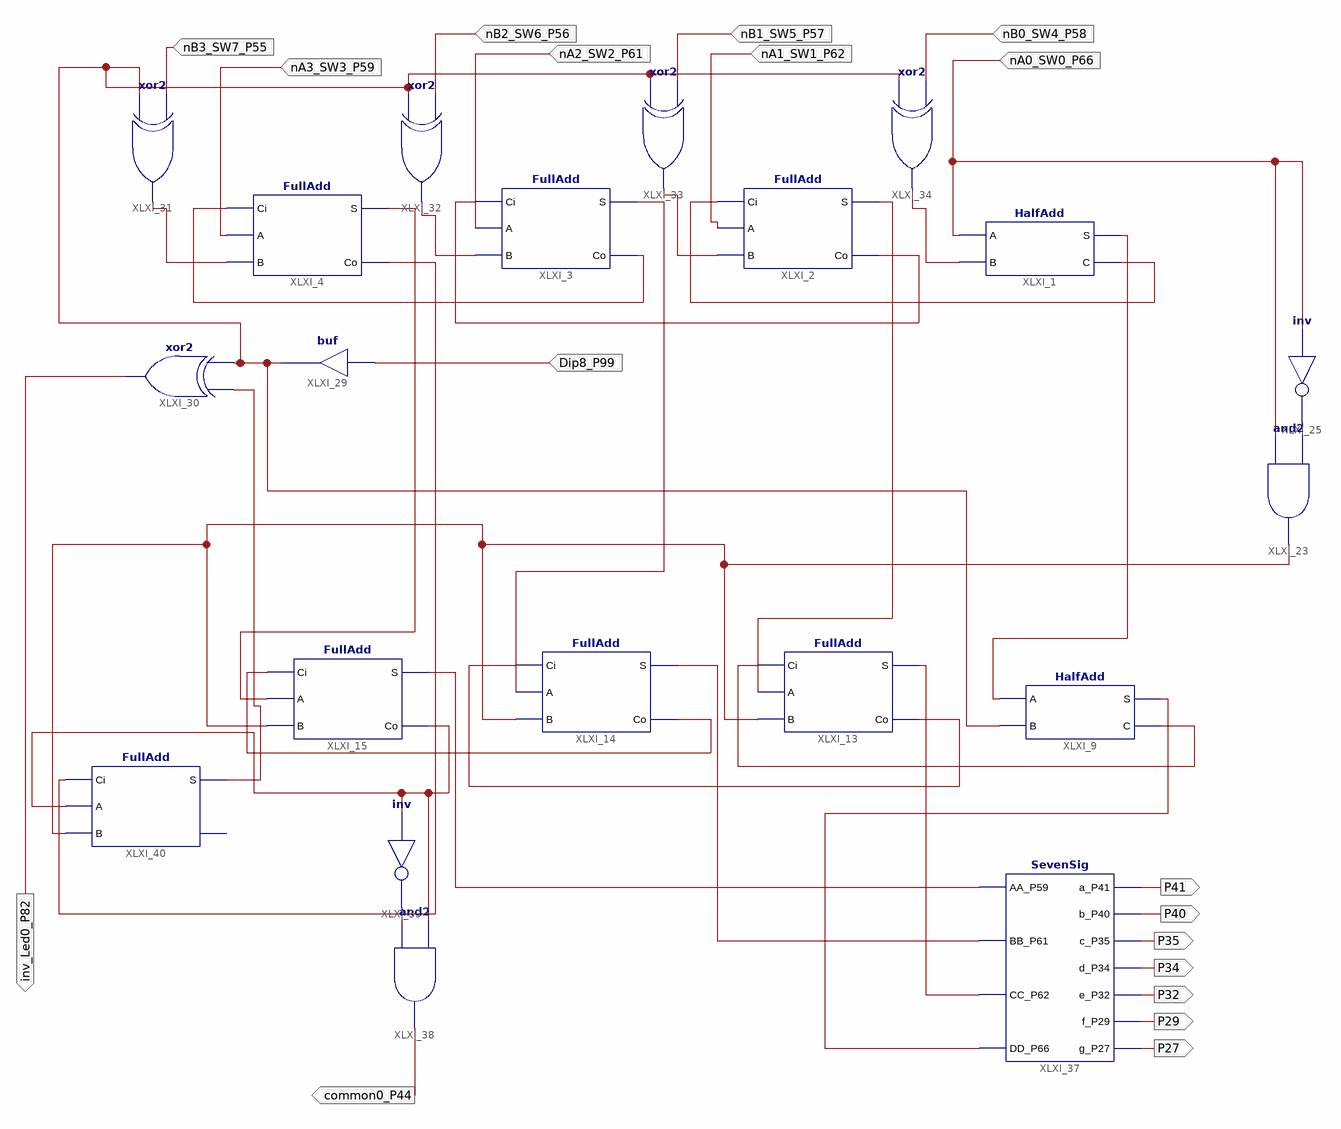
[diagram p0: schematic sheet 1]
// Xilinx ISE schematic Lab6_Mix.sch (spartan6) as structural Verilog: 20 symbols, 18 ports
module Lab6_Mix (
  input  nA0_SW0_P66,
  input  nA1_SW1_P62,
  input  nA2_SW2_P61,
  input  nB0_SW4_P58,
  input  nB1_SW5_P57,
  input  nB2_SW6_P56,
  input  nA3_SW3_P59,
  input  Dip8_P99,
  input  nB3_SW7_P55,
  output inv_Led0_P82,
  output P34,
  output P32,
  output P27,
  output P29,
  output P35,
  output P41,
  output P40,
  output common0_P44
);

  wire s0_Led4_P78, s1_Led5_P75, s2_Led6_P74, sum0_Led4_P78, sum1_Led5_P75, sum2_Led6_P74, sum3_Led7_P67,
       XLXN_3, XLXN_8, XLXN_69, XLXN_74, XLXN_91, XLXN_105, XLXN_106, XLXN_107, XLXN_109, XLXN_115, XLXN_116,
       XLXN_134, XLXN_137, XLXN_152, XLXN_156, XLXN_158, XLXN_159, XLXN_160;

  HalfAdd XLXI_1 (.A(nA0_SW0_P66), .B(XLXN_109), .S(s0_Led4_P78), .C(XLXN_3));
  FullAdd XLXI_2 (.Ci(XLXN_3), .A(nA1_SW1_P62), .B(XLXN_137), .S(s1_Led5_P75), .Co(XLXN_8));
  FullAdd XLXI_3 (.Ci(XLXN_8), .A(nA2_SW2_P61), .B(XLXN_107), .S(s2_Led6_P74), .Co(XLXN_105));
  FullAdd XLXI_4 (.Ci(XLXN_105), .A(nA3_SW3_P59), .B(XLXN_106), .S(XLXN_115), .Co(XLXN_158));
  HalfAdd XLXI_9 (.A(s0_Led4_P78), .B(XLXN_134), .S(sum0_Led4_P78), .C(XLXN_69));
  FullAdd XLXI_13 (.Ci(XLXN_69), .A(s1_Led5_P75), .B(XLXN_159), .S(sum1_Led5_P75), .Co(XLXN_74));
  FullAdd XLXI_14 (.Ci(XLXN_74), .A(s2_Led6_P74), .B(XLXN_159), .S(sum2_Led6_P74), .Co(XLXN_116));
  FullAdd XLXI_15 (.Ci(XLXN_116), .A(XLXN_115), .B(XLXN_159), .S(sum3_Led7_P67), .Co(XLXN_156));
  and XLXI_23 (XLXN_159, nA0_SW0_P66, XLXN_91);
  not XLXI_25 (XLXN_91, nA0_SW0_P66);
  buf XLXI_29 (XLXN_134, Dip8_P99);
  xor XLXI_30 (inv_Led0_P82, XLXN_134, XLXN_160);
  xor XLXI_31 (XLXN_106, XLXN_134, nB3_SW7_P55);
  xor XLXI_32 (XLXN_107, XLXN_134, nB2_SW6_P56);
  xor XLXI_33 (XLXN_137, XLXN_134, nB1_SW5_P57);
  xor XLXI_34 (XLXN_109, XLXN_134, nB0_SW4_P58);
  SevenSig XLXI_37 (
    .AA_P59(sum3_Led7_P67), .BB_P61(sum2_Led6_P74), .CC_P62(sum1_Led5_P75), .DD_P66(sum0_Led4_P78),
    .a_P41(P41), .b_P40(P40), .c_P35(P35), .d_P34(P34), .e_P32(P32), .f_P29(P29), .g_P27(P27));
  and XLXI_38 (common0_P44, XLXN_152, XLXN_156);
  not XLXI_39 (XLXN_152, XLXN_156);
  FullAdd XLXI_40 (.Ci(XLXN_158), .A(XLXN_156), .B(XLXN_159), .S(XLXN_160));  // open: Co

  // Notes on the sheet:
  //   LOC on signal P32 = 
endmodule
